# Altium schematic sheet SSD.SchDoc
size A4; SheetNumber: 4; SheetTotal: 15
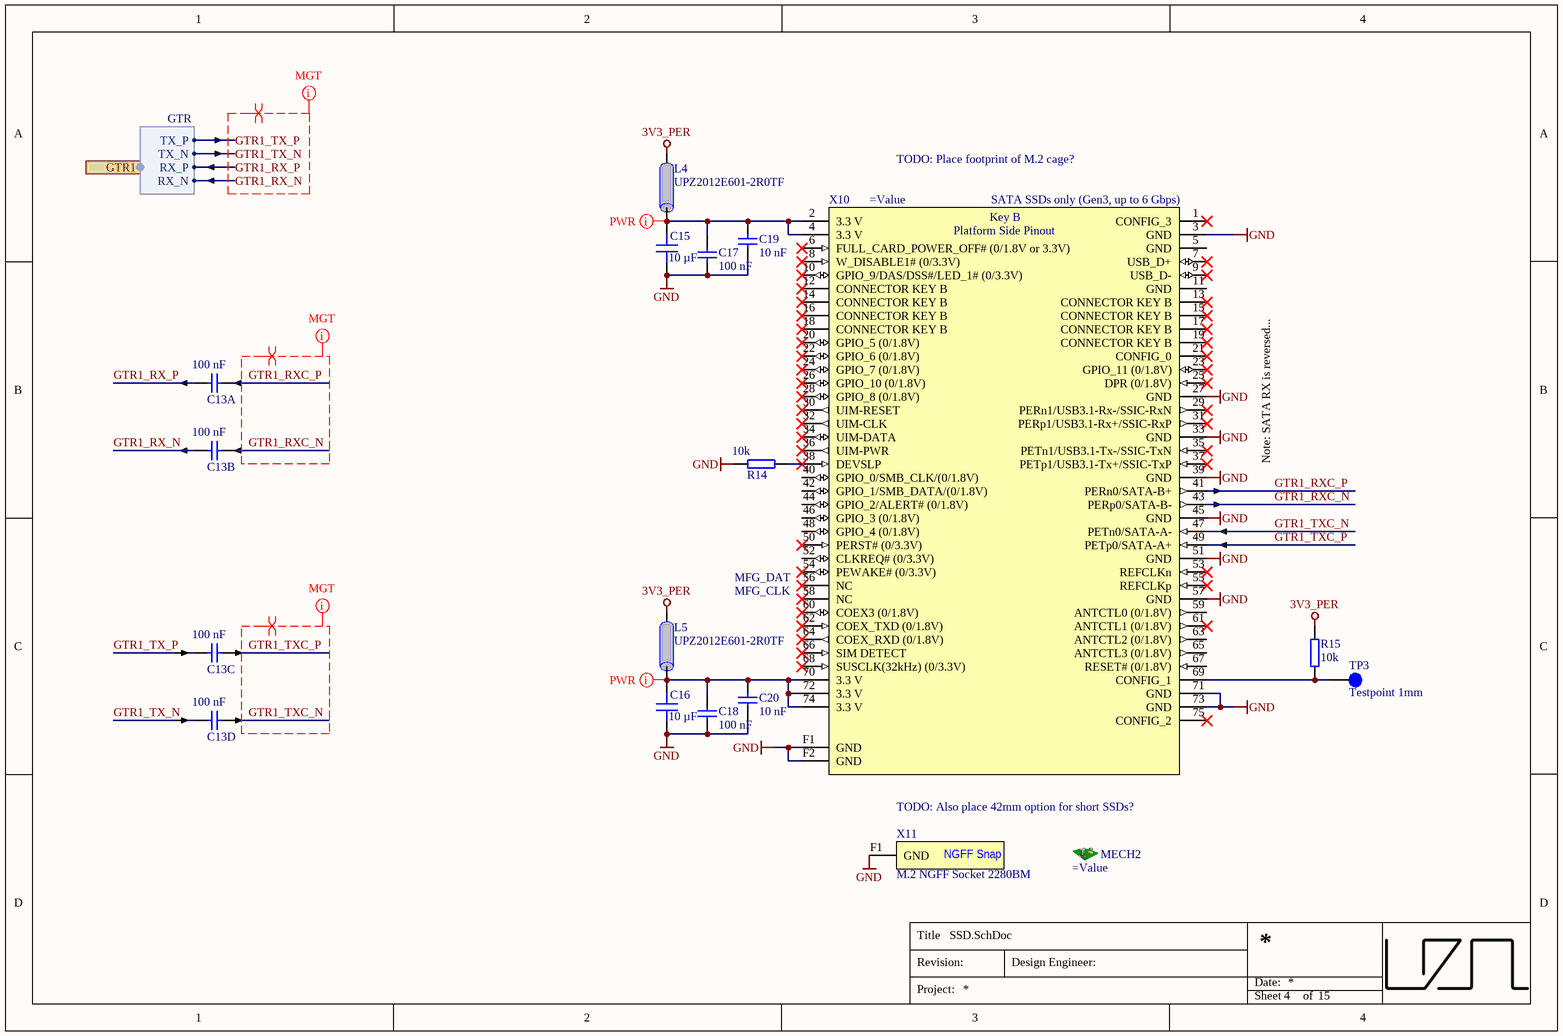
[diagram p0: SSD.SchDoc]

## Parts
C13A  100 nF  [C_0402_TE]
C13B  100 nF  [C_0402_TE]
C13C  100 nF  [C_0402_TE]
C13D  100 nF  [C_0402_TE]
C15  10 µF  [C_0603_TE]
C16  10 µF  [C_0603_TE]
C17  100 nF  [C_0603_TE]
C18  100 nF  [C_0603_TE]
C19  10 nF  [C_0603_TE]
C20  10 nF  [C_0603_TE]
L4  UPZ2012E601-2R0TF  [INDC2012X92N_V]
L5  UPZ2012E601-2R0TF  [INDC2012X92N_V]
MECH2  (no value)  [WA-SMSI-2.5mm]
R14  10k  [R_0603_TE]
R15  10k  [R_0603_TE]
TP3  Testpoint 1mm  [TP_1mm]  (no BOM)
X10  (no value)  [2199230-3]
X11  M.2 NGFF Socket 2280BM  [M.2-NGFF-Socket-2280BM]  (no BOM)

## Ports
GTR1 (harness GTR)

## Harnesses
GTR: RX_N, RX_P, TX_N, TX_P

## Nets
3V3_PER: L4.1 L5.1 R15.2
GND: C15.1 C16.1 C17.1 C18.1 C19.1 C20.1 R14.1 X10.3(GND) X10.27(GND) X10.33(GND) X10.39(GND) X10.45(GND) X10.51(GND) X10.57(GND) X10.71(GND) X10.73(GND) X10.F1(GND) X10.F2(GND) X11.F1(GND)
GTR1_RX_N: C13B.1 ; port GTR1.RX_N
GTR1_RX_P: C13A.1 ; port GTR1.RX_P
GTR1_RXC_N: C13B.2 X10.43(PERp0/SATA-B-)
GTR1_RXC_P: C13A.2 X10.41(PERn0/SATA-B+)
GTR1_TX_N: C13D.1 ; port GTR1.TX_N
GTR1_TX_P: C13C.1 ; port GTR1.TX_P
GTR1_TXC_N: C13D.2 X10.47(PETn0/SATA-A-)
GTR1_TXC_P: C13C.2 X10.49(PETp0/SATA-A+)
NetC15_2: C15.2 C17.2 C19.2 L4.2 X10.2(3.3_V) X10.4(3.3_V)
NetC16_2: C16.2 C18.2 C20.2 L5.2 X10.70(3.3_V) X10.72(3.3_V) X10.74(3.3_V)
NetR14_2: R14.2 X10.38(DEVSLP)
NetR15_1: R15.1 TP3.1 X10.69(CONFIG_1)

Not connected (* = marked no-connect by the designer): X10 1(CONFIG_3)* 5(GND) 6(FULL_CARD_POWER_OFF#_(0/1.8V_or_3.3V))* 7(USB_D+)* 8(W_DISABLE1#_(0/3.3V))* 9(USB_D-)* 10(GPIO_9/DAS/DSS#/LED_1#_(0/3.3V))* 11(GND) 12(CONNECTOR_KEY_B)* 13(CONNECTOR_KEY_B)* 14(CONNECTOR_KEY_B)* 15(CONNECTOR_KEY_B)* 16(CONNECTOR_KEY_B)* 17(CONNECTOR_KEY_B)* 18(CONNECTOR_KEY_B)* 19(CONNECTOR_KEY_B)* 20(GPIO_5_(0/1.8V))* 21(CONFIG_0)* 22(GPIO_6_(0/1.8V))* 23(GPIO_11_(0/1.8V))* 24(GPIO_7_(0/1.8V))* 25(DPR_(0/1.8V))* 26(GPIO_10_(0/1.8V))* 28(GPIO_8_(0/1.8V))* 29(PERn1/USB3.1-Rx-/SSIC-RxN)* 30(UIM-RESET)* 31(PERp1/USB3.1-Rx+/SSIC-RxP)* 32(UIM-CLK)* 34(UIM-DATA)* 35(PETn1/USB3.1-Tx-/SSIC-TxN)* 36(UIM-PWR)* 37(PETp1/USB3.1-Tx+/SSIC-TxP)* 40(GPIO_0/SMB_CLK/(0/1.8V)) 42(GPIO_1/SMB_DATA/(0/1.8V)) 44(GPIO_2/ALERT#_(0/1.8V)) 46(GPIO_3_(0/1.8V)) 48(GPIO_4_(0/1.8V)) 50(PERST#_(0/3.3V))* 52(CLKREQ#_(0/3.3V)) 53(REFCLKn)* 54(PEWAKE#_(0/3.3V))* 55(REFCLKp)* 56(NC)* 58(NC)* 59(ANTCTL0_(0/1.8V)) 60(COEX3_(0/1.8V))* 61(ANTCTL1_(0/1.8V))* 62(COEX_TXD_(0/1.8V))* 63(ANTCTL2_(0/1.8V)) 64(COEX_RXD_(0/1.8V))* 65(ANTCTL3_(0/1.8V)) 66(SIM_DETECT)* 67(RESET#_(0/1.8V)) 68(SUSCLK(32kHz)_(0/3.3V))* 75(CONFIG_2)*

## Layout directives
differential pair: GTR1_RX_N, GTR1_RX_P, GTR1_RXC_N, GTR1_RXC_P, GTR1_TX_N, GTR1_TX_P, GTR1_TXC_N, GTR1_TXC_P
net class MGT: GTR1_RX_N, GTR1_RX_P, GTR1_RXC_N, GTR1_RXC_P, GTR1_TX_N, GTR1_TX_P, GTR1_TXC_N, GTR1_TXC_P
net class PWR: NetC15_2, NetC16_2

## Notes on the sheet
- TODO: Place footprint of M.2 cage?
- (near X10) SATA SSDs only (Gen3, up to 6 Gbps)
- Note: SATA RX is reversed...
- MFG_DAT
- MFG_CLK
- TODO: Also place 42mm option for short SSDs?
- Title
- Revision:
- Design Engineer:
- Date:
- Project:
- Sheet
- of
- (in symbol 1-2199230-5) Key B; Platform Side Pinout
- (in symbol M.2 NGFF Socket 2280BM) NGFF Snap

## Library data of the parts
C13A C13B C13C C13D = UZgen_C_0402_100nF_50V_X7R: Generic capacitor; Manufacturer: UZgen; Voltage: 50V; Tolerance: 10 %; Created from: UZgenTool; Manufacturer Part Number: UZgen_C_0402_100nF_50V_X7R; PartID: 3431; Created On: 02/08/2024 11:17:51; Value: 100 nF; Device Package: 0402; Technology: X7R; Mounting Type: SMD; Last Updated: 02/08/2024 11:17:51
C15 C16 = CL10A106MO8NQNC: Capacitor 0603, 16 VDC, 10 µF, X5R; Manufacturer: Samsung Electro-Mechanics; Tolerance: 20 %; Voltage Rating: 16 VDC; Created from: AGeiger; Manufacturer Part Number: CL10A106MO8NQNC; PartID: 101; Created On: 22/08/2022 13:56:44; ComponentLink1Description: Datasheet; ComponentLink1URL: https://datasheet.lcsc.com/lcsc/1810261909_Samsung-Electro-Mechanics-CL10A106MO8NQNC_C92487.pdf; Component Type: Capacitor 0603; Device Package: 0603; Last Updated: 19/11/2024 12:40:46; Mounting Type: SMD; Operating Temperature: -55 - 85°C; Supplier 1: LCSC; Supplier Part Number 1: C92487; Type: Capacitor; Value: 10 µF; Live Cycle Status: 1; LCSC Part Number: C92487; Series: X5R
C17 C18 = UZgen_C_0603_100nF_50V_X7R: Generic capacitor; Manufacturer: UZgen; Voltage: 50V; Tolerance: 10 %; Created from: AGeiger; Manufacturer Part Number: UZgen_C_0603_100nF_50V_X7R; PartID: 1; Created On: 02/07/2024 14:42:23; Value: 100 nF; Device Package: 0603; Technology: X7R; Mounting Type: SMD; Last Updated: 08/08/2024 15:01:15
C19 C20 = UZgen_C_0603_10nF_50V_X7R: Generic capacitor; Manufacturer: UZgen; Tolerance: 10 %; Created from: UZgenTool; Voltage: 50V; Manufacturer Part Number: UZgen_C_0603_10nF_50V_X7R; PartID: 4263; Created On: 02/08/2024 11:18:09; Device Package: 0603; Last Updated: 02/08/2024 11:18:09; Mounting Type: SMD; Value: 10 nF; Technology: X7R
L4 L5 = UPZ2012E601-2R0TF: 2A 1 90mΩ 600Ω@100MHz ±25% 0805  Ferrite Beads ROHS; Manufacturer: Sunlord; Value: 90 Ohm; Created from: AGeiger; Manufacturer Part Number: UPZ2012E601-2R0TF; PartID: 11; Created On: 03.09.2022 16:57:01; ComponentLink1Description: Datasheet; ComponentLink1URL: https://datasheet.lcsc.com/lcsc/2110091730_Sunlord-UPZ2012E601-2R0TF_C98308.pdf; Component Type: Ferrite Beads; Device Package: 0805; Last Updated: 03.09.2022 17:01:04; Mounting Type: SMD; Operating Temperature: -55 - 125 °C; Supplier 1: LCSC; Supplier Part Number 1: C98308; Type: Ferrite Bead; DC current: 2 A; Live Cycle Status: 1; LCSC Part Number: C98308
MECH2 = SMTSOM325BTR: SMD Nut; Manufacturer: YIYUAN; AN: 32101; Mixed: THT; H-ART: 9774025360; Temperature-Range: -55/+150 (Abs); Extra: WA-SMSI; Created from: AGeiger; HelpURL: B:\AD\adlib\datasheet\WE_9774025360; LCSC Part #: C5301784; Manufacturer Part Number: SMTSOM325BTR; PartID: 13; Created On: 06.06.2023 08:57:00; ComponentLink1Description: Datasheet; ComponentLink1URL: https://datasheet.lcsc.com/lcsc/2302021209_YIYUAN-SMTSOM325BTR_C5301784.pdf; Last Updated: 06.06.2023 08:57:00; Mounting Type: SMD; Series: M2; Supplier 1: LCSC; Supplier Part Number 1: C5301784; Value: SMTSOM325BTR; LCSC Part Number: C5301784
R14 R15 = UZgen_R_0603_10k: Generic resistor; Manufacturer: UZgen; Tolerance: 1 %; Created from: AGeiger; Manufacturer Part Number: UZgen_R_0603_10k; PartID: 1; Created On: 02/07/2024 14:34:53; Value: 10k; Device Package: 0603; Mounting Type: SMD; Last Updated: 02/07/2024 14:37:16
TP3 = NULL: Manufacturer Part Number: NULL; Created from: AGeiger; Created: 2018_06_25_AGeiger; Value: Testpoint 1mm; PartID: 9; Created On: 20/09/2022 13:14:57; Component Type: Testpoint; Last Updated: 20/09/2022 13:15:39; Manufacturer: NULL; Supplier 1: NULL; Supplier Part Number 1: NULL; Type: Testpoint; Live Cycle Status: 1
X10 = 1-2199230-5: M.2 0.5mm Surface Mount 67 SMD,P=0.5mm Card Edge Connectors ROHS; Manufacturer: TE Connectivity; AN: 31952; Mixed: SMT; Temperature-Range: -40/+80; Extra: Socket 67pol. 4.2mm; Created from: AGeiger; Case: M.2 B; HelpURL: B:\AD\adlib\datasheet\TE\2199230-3; H-ART: 2199230-3; LCSC Part #: C590854; Manufacturer Part Number: 1-2199230-5; PartID: 12; Created On: 06.06.2023 08:54:40; ComponentLink1Description: Datasheet; ComponentLink1URL: https://datasheet.lcsc.com/lcsc/2008241633_TE-Connectivity-1-2199230-5_C590854.pdf; Last Updated: 06.06.2023 08:54:40; Mounting Type: SMD; Operating Temperature: -40 °C to +80 °C; Series: M2; Supplier 1: LCSC; Supplier Part Number 1: C590854; Value: 1-2199230-5; LCSC Part Number: C590854
X11 = M.2 NGFF Socket 2280BM: M.2 NGFF Socket 2280BM Snap; Manufacturer: n.a.; AN: 26274; Mixed: SMT; Extra: Variant of 25485; Created from: AGeiger; HelpURL: B:\AD\adlib\datasheet\1-2199119-0; Manufacturer Part Number: M.2 NGFF Socket 2280BM; PartID: 15; Created On: 06.06.2023 09:01:36; ComponentLink1Description: Datasheet; ComponentLink1URL: https://datasheet.lcsc.com/lcsc/2302021209_YIYUAN-SMTSOM325BTR_C5301784.pdf; Last Updated: 06.06.2023 09:04:37; Series: M2; Supplier 1: n.a.; Supplier Part Number 1: n.a.; Value: M.2 NGFF Socket 2280BM